# EAGLE design MJ818 clone - all driver (EAGLE 9.4.0)
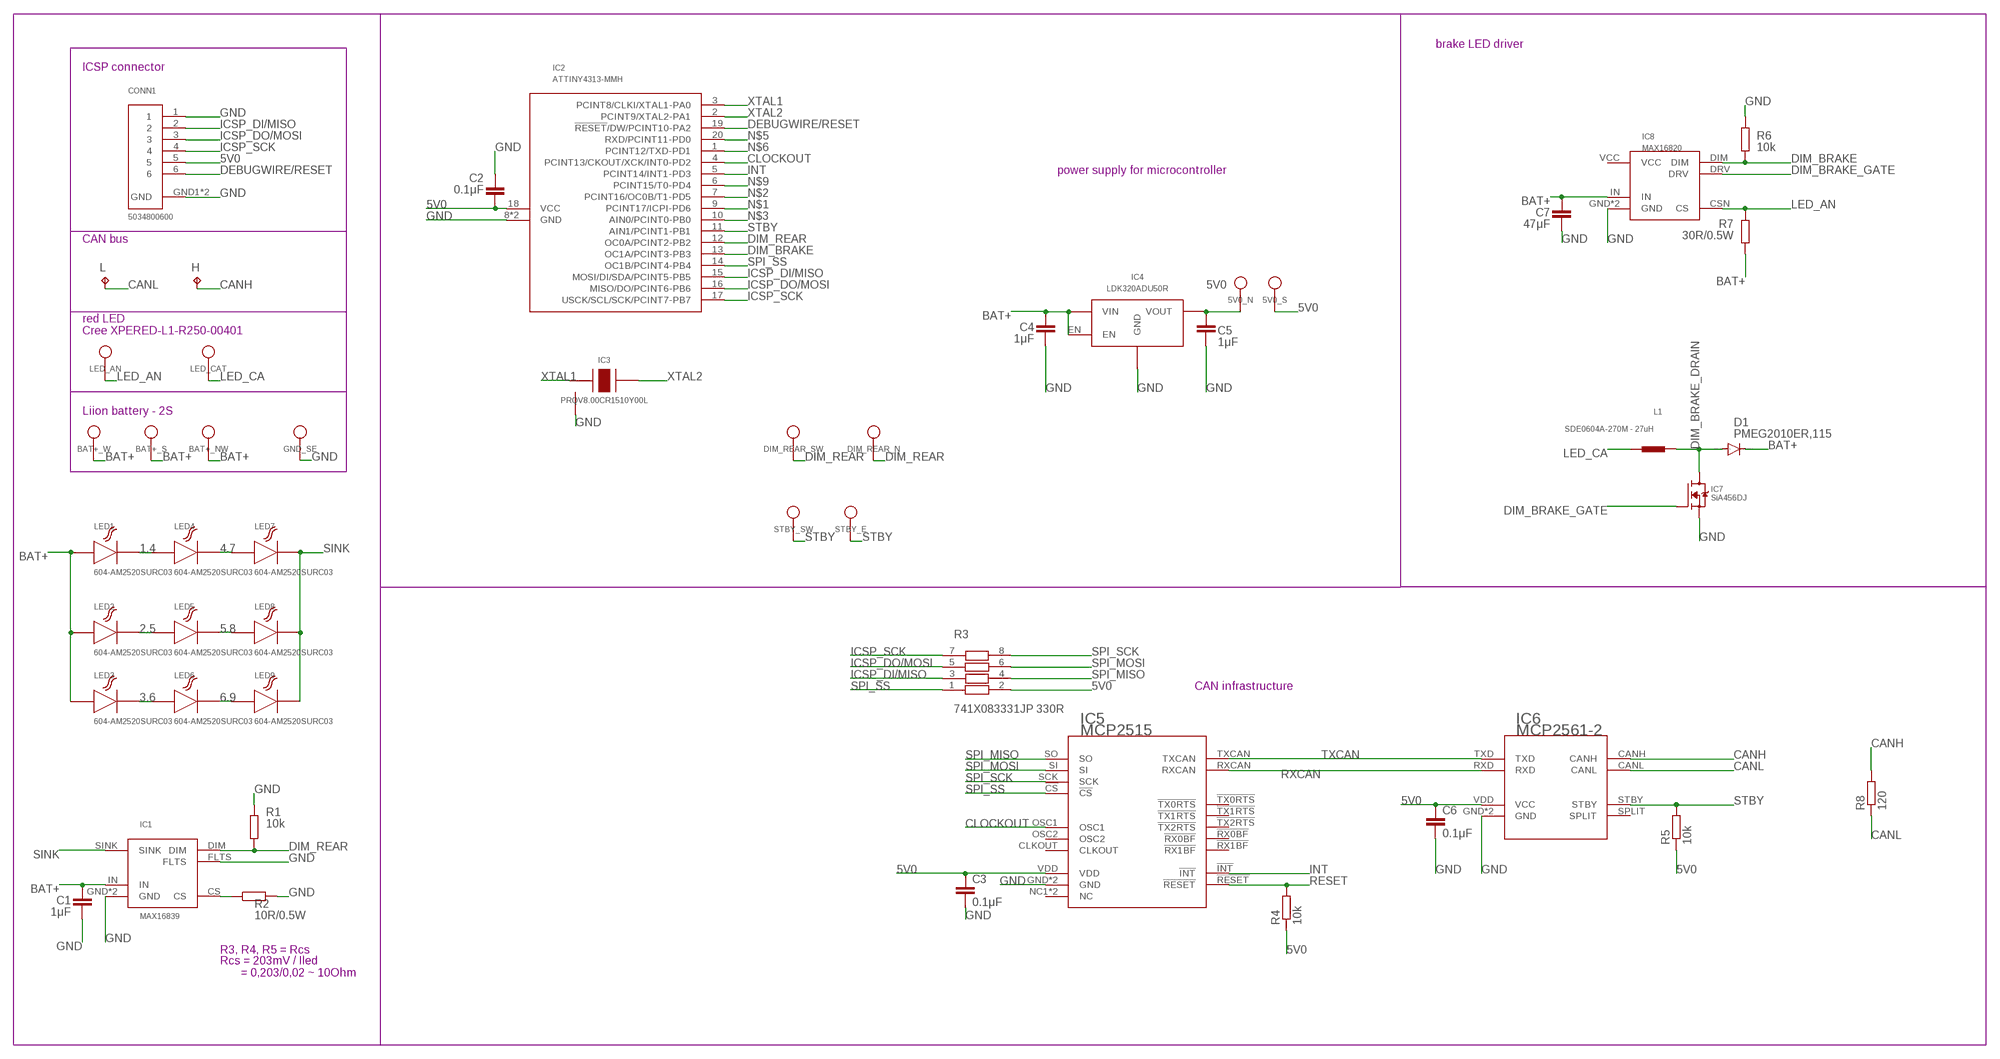
[diagram p0: schematic, sheet 1]

## Parts
5V0_N  TPTH  [TH]
5V0_S  TPTH  [TH]
BAT+_NW  TPTH  [TH]
BAT+_S  TPSMT  [SMT]
BAT+_W  TPTH  [TH]
C1  1μF  C-EUC0402  [C0402]
C2  0.1μF  C-EUC0402  [C0402]
C3  0.1μF  C-EUC1206  [C1206]
C4  1μF  C-EUC0402  [C0402]
C5  1μF  C-EUC0402  [C0402]
C6  0.1μF  C-EUC1206  [C1206]
C7  47μF  C-EUC1206  [C1206]
CONN1  5034800600  [SMT]
D1  PMEG2010ER,115  DIODE-SOD123  [SOD123]
DIM_REAR_N  TPTH  [TH]
DIM_REAR_SW  TPTH  [TH]
GND_SE  TPTH  [TH]
H  TPB2,54  [B2,54]
IC1  MAX16839  MAX16839  [TDFN-6-EP]
IC2  ATTINY4313-MMH  ATTINY4313VQFN-20  [VQFN-20]
IC3  PRQV8.00CR1510Y00L  PRQV  [SMT]
IC4  LDK320ADU50R  LDK320SOT-23-5L  [SOT-23-5L]
IC5  MCP2515  MCP2515-I-ML  [QFN20]
IC6  MCP2561-2  [DFN10]
IC7  SiA456DJ  SIA456DJ  [SC-70-6]
IC8  MAX16820  [TDFN-6-EP]
L  TPB2,54  [B2,54]
L1  SDE0604A-270M - 27uH  DE0604A-778075  [SMT]
LED1  604-AM2520SURC03  AM2520SURC03-31454  [SMD]
LED2  604-AM2520SURC03  AM2520SURC03-31454  [SMD]
LED3  604-AM2520SURC03  AM2520SURC03-31454  [SMD]
LED4  604-AM2520SURC03  AM2520SURC03-31454  [SMD]
LED5  604-AM2520SURC03  AM2520SURC03-31454  [SMD]
LED6  604-AM2520SURC03  AM2520SURC03-31454  [SMD]
LED7  604-AM2520SURC03  AM2520SURC03-31454  [SMD]
LED8  604-AM2520SURC03  AM2520SURC03-31454  [SMD]
LED9  604-AM2520SURC03  AM2520SURC03-31454  [SMD]
LED_AN  TPTH  [TH]
LED_CAT  TPTH  [TH]
R1  10k  R-EU_R0402  [R0402]
R2  10R/0.5W  R-EU_R0603  [R0603]
R3  741X083331JP 330R  741X083331JP  [0402]
R4  10k  R-EU_R0402  [R0402]
R5  10k  R-EU_R0603  [R0603]
R6  10k  R-EU_R0402  [R0402]
R7  30R/0.5W  R-EU_R1206  [R1206]
R8  120  R-EU_R0805  [R0805]
STBY_E  TPTH  [TH]
STBY_SW  TPTH  [TH]

## Nets
1.4 [currett-0.25mA]: LED1.C LED4.A
2.5 [currett-0.25mA]: LED2.C LED5.A
3.6 [currett-0.25mA]: LED3.C LED6.A
4.7 [currett-0.25mA]: LED4.C LED7.A
5.8 [currett-0.25mA]: LED5.C LED8.A
5V0 [VCC]: 5V0_N.TP$1 5V0_S.TP$1 C2.1 C3.1 C5.2 C6.1 CONN1.5 IC2.18(VCC) IC4.OUT(VOUT) IC5.VDD IC6.VDD(VCC) R3.2 R4.1 R5.1
6.9 [currett-0.25mA]: LED6.C LED9.A
BAT+ [currett-0.25mA]: BAT+_NW.TP$1 BAT+_S.P$1(TP$1) BAT+_W.TP$1 C1.2 C4.1 C7.1 D1.C IC1.IN IC4.EN IC4.IN(VIN) IC8.IN LED1.A LED2.A LED3.A R7.2
CANH [signal]: H.TP IC6.CANH R8.2
CANL [signal]: IC6.CANL L.TP R8.1
CLOCKOUT [signal]: IC2.4(PCINT13/CKOUT/XCK/INT0-PD2) IC5.OSC1
CS [signal]: IC1.CS R2.1
DEBUGWIRE/RESET [signal]: CONN1.6 IC2.19(!RESET!/DW/PCINT10-PA2)
DIM_BRAKE [signal]: IC2.13(OC1A/PCINT3-PB3) IC8.DIM R6.1
DIM_BRAKE_DRAIN: D1.A IC7.1D(D) IC7.2D(D) IC7.5D(D) IC7.6D(D) IC7.D L1.P$2
DIM_BRAKE_GATE [signal]: IC7.3G(G) IC8.DRV
DIM_REAR [signal]: DIM_REAR_N.TP$1 DIM_REAR_SW.TP$1 IC1.DIM IC2.12(OC0A/PCINT2-PB2) R1.1
GND: C1.1 C2.2 C3.2 C4.2 C5.1 C6.2 C7.2 CONN1.1 CONN1.GND1(GND) CONN1.GND2(GND) GND_SE.TP$1 IC1.FLTS IC1.GND IC1.GND1(GND) IC2.8(GND) IC2.GND IC3.GND IC4.GND IC5.GND IC5.GND6(GND) IC6.GND IC6.VSS(GND) IC7.4S(S) IC7.S IC8.GND IC8.GND1(GND) R1.2 R2.2 R6.2
ICSP_DI/MISO [signal]: CONN1.2 IC2.15(MOSI/DI/SDA/PCINT5-PB5) R3.3
ICSP_DO/MOSI [signal]: CONN1.3 IC2.16(MISO/DO/PCINT6-PB6) R3.5
ICSP_SCK [signal]: CONN1.4 IC2.17(USCK/SCL/SCK/PCINT7-PB7) R3.7
INT [signal]: IC2.5(PCINT14/INT1-PD3) IC5.!INT!
LED_AN [currett-0.25mA]: IC8.CSN(CS) LED_AN.TP$1 R7.1
LED_CA: L1.P$1 LED_CAT.TP$1
N$1: IC2.9(PCINT17/ICPI-PD6)
N$2: IC2.7(PCINT16/OC0B/T1-PD5)
N$3: IC2.10(AIN0/PCINT0-PB0)
N$5: IC2.20(RXD/PCINT11-PD0)
N$6: IC2.1(PCINT12/TXD-PD1)
N$9: IC2.6(PCINT15/T0-PD4)
RESET [signal]: IC5.!RESET! R4.2
RXCAN [signal]: IC5.RXCAN IC6.RXD
SINK [currett-0.25mA]: IC1.SINK LED7.C LED8.C LED9.C
SPI_MISO [signal]: IC5.SO R3.4
SPI_MOSI [signal]: IC5.SI R3.6
SPI_SCK [signal]: IC5.SCK R3.8
SPI_SS [signal]: IC2.14(OC1B/PCINT4-PB4) IC5.!CS! R3.1
STBY [signal]: IC2.11(AIN1/PCINT1-PB1) IC6.STBY R5.2 STBY_E.TP$1 STBY_SW.TP$1
TXCAN [signal]: IC5.TXCAN IC6.TXD
XTAL1 [signal]: IC2.3(PCINT8/CLKI/XTAL1-PA0) IC3.XTAL1
XTAL2 [signal]: IC2.2(PCINT9/XTAL2-PA1) IC3.XTAL2
Unconnected: IC5.!RX0BF! IC5.!RX1BF! IC5.!TX0RTS! IC5.!TX1RTS! IC5.!TX2RTS! IC5.CLKOUT IC5.NC1(NC) IC5.NC2(NC) IC5.OSC2 IC6.SPLIT

## Notes on the sheet
- brake LED driver
- ICSP connector
- power supply for microcontroller
- CAN bus
- red LED
  Cree XPERED-L1-R250-00401
- Liion battery - 2S
- CAN infrastructure
- R3, R4, R5 = Rcs
- Rcs = 203mV / Iled
         = 0,203/0,02 ~ 10Ohm

## Power pins joined to a net without a drawn wire
VCC: IC8.VCC

## Library data of the parts
5V0_N 5V0_S BAT+_NW BAT+_S BAT+_W DIM_REAR_N DIM_REAR_SW GND_SE LED_AN LED_CAT STBY_E STBY_SW = signal testpoint:TP
C1-C7 = rcl:C-EU: CAPACITOR, European symbol; SPICEPREFIX: C
CONN1 = 5034800600 FPC Connector:5034800600
D1 = diode:DIODE-: DIODE
H L = testpad:TP: Test pad
IC1 = MAX16839 LED Driver, constant current:MAX16839
IC2 = ATtiny4313 microcontroller:ATTINY4313; SPICEPREFIX: X
IC3 = PRQV8.00CR1510Y00L - 8MHz resonator:PRQV
IC4 = LDK320 5V LDO:LDK320
IC5 = MCP2515-I-ML - Standalonce CAN Controller with SPI Interface:MCP2515-I-ML
IC6 = MCP2561-2 - High-Speed CAN Transceiver:MCP2561-2
IC7 = SIA456DJ-T1-GE3  N-Fet:SIA456DJ
IC8 = MAX16820 LED Driver, constant current:MAX16820
L1 = DE0604A-778075 - Inductor:DE0604A-778075
LED1-LED9 = AM2520SURC03-31454 - Red SMD LED:AM2520SURC03-31454
R1 R2 R4-R8 = rcl:R-EU_: RESISTOR, European symbol; SPICEPREFIX: R
R3 = 74x-1133528 Resistor Array:741X083331JP

## Net classes
0 GND: width 0.254 mm, drill 0.254 mm, clearance 0.127 mm
1 VCC: width 0.254 mm, drill 0.254 mm, clearance 0.127 mm
2 signal: width 0.127 mm, drill 0.254 mm, clearance 0.127 mm
3 5V0CAN: width 0.254 mm, drill 0.254 mm, clearance 0.127 mm
4 5V0_μC: width 0.254 mm, drill 0.254 mm, clearance 0.127 mm
5 currett-0.25mA: width 0.254 mm, drill 0.254 mm, clearance 0.127 mm

## Board
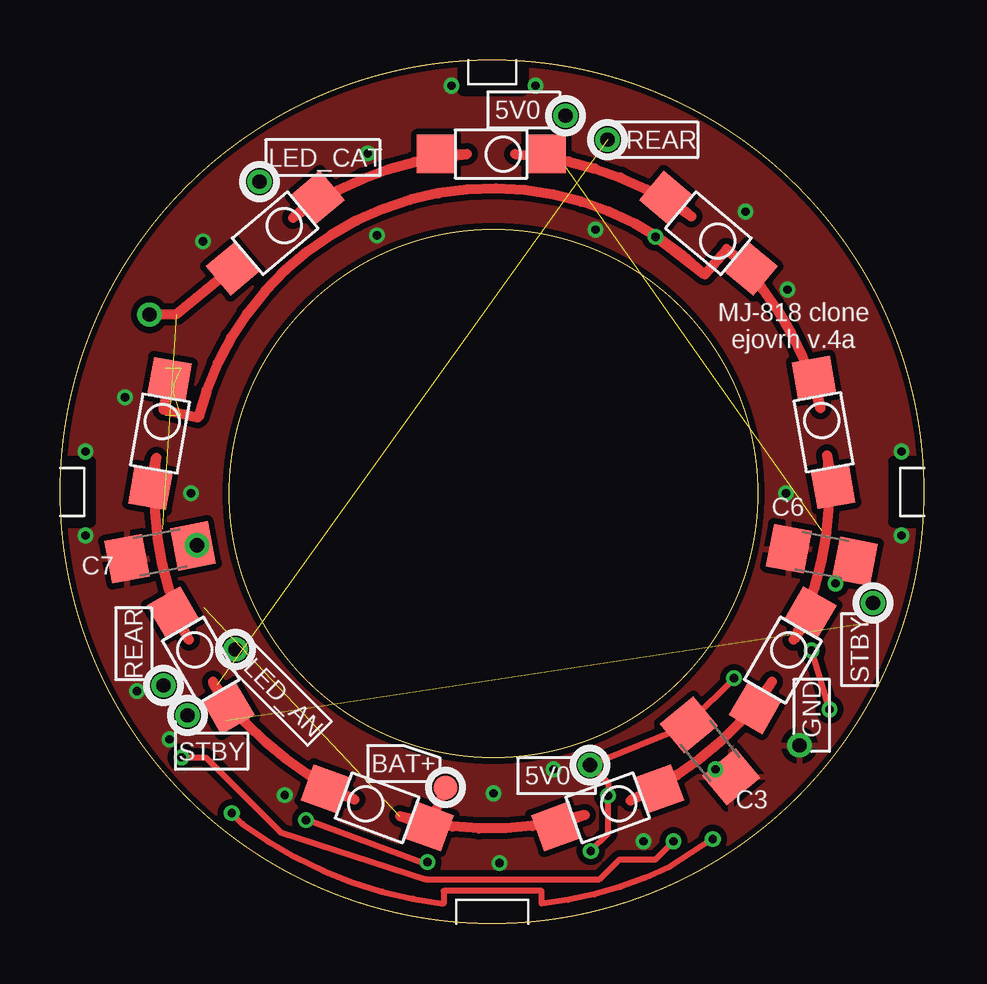
[diagram p1: board, top side]
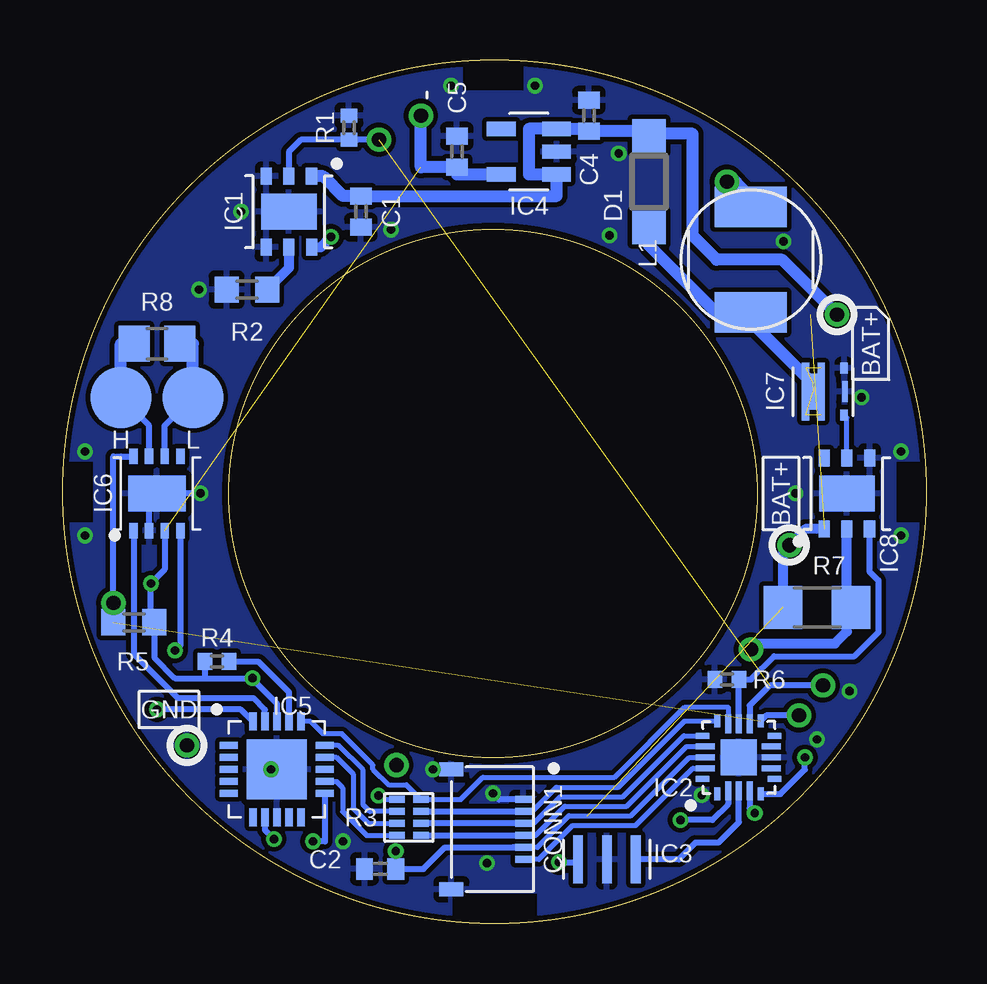
[diagram p2: board, bottom side, seen from below]

Size 36 x 36 mm. Coordinates in mm from the lower left corner, seen from the top.
Outline: 36,17.5 36,18.5
Outline: circle at 18,18 radius 18
Outline: circle at 18.07,17.93 radius 11
Copper layers (1*16): Top 0.035mm / dielectric 1.5mm / Bottom 0.035mm
Design rules "markovac_2layer *": minimum track width 0.2mm, minimum drill 0.35mm, track to track 0.2mm, track to pad 0.2mm, pad to pad 0.2mm, via to via 0.2mm, smd to smd 0.2mm, copper to edge 0.25mm, drill to drill 8mil, minimum pad ring 0.15mm, minimum via ring 0.15mm, stop-mask expansion 4mil, vias tented up to drill 0.34mm, thermal gap 10mil
tKeepout: area 34.8,16.8 to 36,19.2; area 0,16.8 to 1.2,19.2; 4 lines
bKeepout: area 0,16.8 to 1.2,19.2; 4 lines
tRestrict: area 34.8,16.8 to 36,19.2; area 16.8,34.8 to 19.3,36; area 16.8,34.8 to 19.3,36; area 0,16.8 to 1.2,19.2; area 16.2,0 to 19.8,1.2; area 16.2,0 to 19.8,1.2
bRestrict: area 34.8,16.8 to 36,19.2; area 34.8,16.8 to 36,19.2; area 16.8,34.8 to 19.3,36; area 16.8,34.8 to 19.3,36; area 0,16.8 to 1.2,19.2; area 16.2,0 to 19.8,1.2; area 16.2,0 to 19.8,1.2

### Footprints (pad centres in the part's own frame; a part is rotated, then mirrored left to right if it is on the bottom)
TH = drill 0.6 pad 1.016: TP$1 0,0
SMT = smd 1 x 1: P$1 0,0
C0402 = smd 0.7 x 0.9: 1 -0.65,0; 2 0.65,0
C1206 = smd 1.6 x 1.8: 1 -1.4,0; 2 1.4,0
SMT' = smd 0.3 x 0.7: 1 -1.25,1.27; 2 -0.75,1.27; 3 -0.25,1.27; 4 0.25,1.27; 5 0.75,1.27; 6 1.25,1.27 | smd 0.6 x 1: GND1 -2.5,-1.73; GND2 2.5,-1.73
SOD123 = smd 1.4 x 1.4: A 1.9,0; C -1.9,0
B2,54 = smd 2.54 x 2.54: TP 0,0
TDFN-6-EP = smd 0.71 x 0.46: CS 1.48,0; DIM -1.48,0; FLTS -1.48,-0.94; GND1 1.48,-0.95; IN -1.48,0.94; SINK 1.48,0.95 | smd 1.5 x 2.3: GND 0,0
VQFN-20 = smd 0.55 x 0.25: 1 -1.52,0.9; 5 -1.52,-0.9; 11 1.52,-0.9; 15 1.52,0.9 | smd 0.8 x 0.25: 2 -1.4,0.45; 3 -1.4,0; 4 -1.4,-0.45; 12 1.4,-0.45; 13 1.4,0; 14 1.4,0.45 | smd 0.25 x 0.55: 6 -0.9,-1.48; 10 0.9,-1.48; 16 0.9,1.52; 20 -0.9,1.52 | smd 0.25 x 0.8: 7 -0.45,-1.35; 8 0,-1.35; 9 0.45,-1.35; 17 0.45,1.4; 18 0,1.4; 19 -0.45,1.4 | smd 1.5 x 1.5: GND 0,0
SMT'' = smd 0.4 x 2: GND 0,0; XTAL1 -1.2,0; XTAL2 1.2,0
SOT-23-5L = smd 0.6 x 1.2: ADJ/NC -0.95,-1.15; EN -0.95,1.15; GND 0,1.15; IN 0.95,1.15; OUT 0.95,-1.15
QFN20 = smd 0.3 x 0.75: !CS! 1,2; !RESET! 0.5,2; !RX0BF! 1,-2; !RX1BF! 0.5,-2; GND6 0,-2; OSC1 -0.5,-2; OSC2 -1,-2; RXCAN -1,2; TXCAN -0.5,2; VDD 0,2 | smd 0.75 x 0.3: !INT! 2,-1; !TX0RTS! -2,0.5; !TX1RTS! -2,0; !TX2RTS! -2,-1; CLKOUT -2,1; NC1 -2,-0.5; NC2 2,0; SCK 2,-0.5; SI 2,0.5; SO 2,1 | smd 2.5 x 2.5: GND 0,0
DFN10 = smd 0.35 x 0.65: CANH -0.325,1.55; CANL 0.325,1.55; RXD 0.975,-1.55; SPLIT 0.975,1.55; STBY -0.975,1.55; TXD -0.975,-1.55; VDD 0.325,-1.55; VSS -0.325,-1.55 | smd 2.4 x 1.5: GND 0,0
SC-70-6 = smd 0.45 x 0.3: 1D -0.975,0.725; 2D -0.975,0.075; 3G -0.975,-0.88; 4S 0.975,-0.88; 5D 0.975,0.075; 6D 0.975,0.725 | smd 1.5 x 0.95: D 0,0.4 | smd 0.87 x 0.23: S 0,-0.915
TDFN-6-EP' = smd 0.71 x 0.46: CSN -1.48,0; DIM -1.48,-0.94; DRV 1.48,0; GND1 1.48,-0.95; IN -1.48,0.94; VCC 1.48,0.95 | smd 1.5 x 2.3: GND 0,0
SMT''' = smd 1.7 x 3: P$1 2.2,0; P$2 -2.2,0
SMD = smd 1.6 x 1.6: A -2.3,0; C 2.3,0
R0402 = smd 0.6 x 0.7: 1 -0.5,0; 2 0.5,0
R0603 = smd 1 x 1.1: 1 -0.85,0; 2 0.85,0
0402 = smd 0.65 x 0.3: 1 -0.5,-0.75; 2 0.5,-0.75; 3 -0.5,-0.25; 4 0.5,-0.25; 5 -0.5,0.25; 6 0.5,0.25; 7 -0.5,0.75; 8 0.5,0.75
R1206 = smd 1.6 x 1.803: 1 -1.422,0; 2 1.422,0
R0805 = smd 1.3 x 1.5: 1 -0.95,0; 2 0.95,0

### Placement (x,y rotation side)
5V0_N  21.07,33.68 180 top
5V0_S  22.09,6.61 0 top
BAT+_NW  3.73,25.39 0 bottom
BAT+_S  16.07,5.68 0 top
BAT+_W  5.72,15.78 0 bottom
C1  23.57,29.68 90 bottom
C2  22.77,2.28 180 bottom
C3  27.09,7.2 309.3 top
C4  14.07,33.68 90 bottom
C5  19.57,32.18 270 bottom
C6  31.74,15.36 169.2 top
C7  4.17,15.48 191 top
CONN1  5034800600  [SMT']  18.07,3.93 270 bottom
D1  11.57,30.93 270 bottom
DIM_REAR_N  22.82,32.68 0 top
DIM_REAR_SW  4.32,9.93 0 top
GND_SE  30.82,7.43 180 bottom
H  33.57,21.93 90 bottom
IC1  26.57,29.68 270 bottom
IC2  7.82,6.93 90 bottom
IC3  PRQV8.00CR1510Y00L  [SMT'']  13.32,2.68 180 bottom
IC4  16.57,32.18 270 bottom
IC5  27.07,6.43 0 bottom
IC6  32.07,17.93 0 bottom
IC7  4.32,22.18 90 bottom
IC8  MAX16820  [TDFN-6-EP']  3.32,17.93 90 bottom
L  30.57,21.93 90 bottom
L1  SDE0604A-270M - 27uH  [SMT''']  7.32,27.68 90 bottom
LED1  22.82,4.83 20 top
LED2  13.22,4.83 160 top
LED3  8.97,28.78 40 top
LED4  30.12,10.98 60 top
LED5  5.87,10.98 120 top
LED6  17.97,32.08 0 top
LED7  31.82,20.48 100 top
LED8  4.17,20.43 80 top
LED9  27.02,28.78 320 top
LED_AN  7.32,11.43 0 top
LED_CAT  8.32,30.93 0 top
R1  24.07,33.18 90 bottom
R2  28.32,26.43 180 bottom
R3  21.57,4.43 180 bottom
R4  29.57,10.93 0 bottom
R5  33.03,12.56 180 bottom
R6  8.32,10.18 180 bottom
R7  4.57,13.18 180 bottom
R8  32.07,24.18 180 bottom
STBY_E  33.88,13.37 0 top
STBY_SW  5.32,8.68 0 top

### Tracks (layer width: path | path; a pad name or v marks a point on that pad's centre or on a via)
1.4
  Top 0.406: LED4.A 29.67,10.08 arc-32 23.77,5.13 LED1.C
2.5
  Top 0.254: LED2.C
  Top 0.406: LED2.C 12.27,5.18 arc-32 6.37,10.08 LED5.A
3.6
  Top 0.406: LED6.A 16.97,32.08 arc32 9.72,29.43 LED3.C | LED3.C
4.7
  Top 0.254: LED7.A
  Top 0.406: LED7.A 31.97,19.53 arc-32 30.57,11.83 LED4.C
5.8
  Top 0.254: LED8.A
  Top 0.406: LED5.C 5.37,11.83 arc-32 4.02,19.43 LED8.A
5V0  (via drill 0.35)  (1 unrouted)
  Top 0.254: 22.32,3.23 v22.12,3.03 22.84,3.75 v22.84,5.33 22.84,5.86 5V0_S.TP$1 C3.1 26.3,8.44 v28.09,10.23 | v32.32,14.18 C6.1
  Bottom 0.2: IC2.18 9.88,6.93 12.31,4.49 14.9,4.49 16.22,3.18 CONN1.5 | v22.84,5.33 22.69,5.18 R3.2
  Bottom 0.254: 17.27,3.18 CONN1.5 20.07,3.18 20.97,2.28 C2.1 v22.12,3.03 | IC5.VDD 27.07,9.18 28.09,10.2 v28.09,10.23 30.07,10.23 | IC6.VDD | 30.07,10.23 31.32,10.23 32.18,11.09 R5.1 32.32,12.7 v32.32,14.18 31.74,14.75 IC6.VDD | R4.1 30.07,10.23
  Bottom 0.508: IC4.OUT 19.57,31.23 C5.2 21.07,31.53 5V0_N.TP$1
6.9
  Top 0.305: LED6.C 18.97,32.08 | LED9.A 25.48,30.18
  Top 0.406: 25.48,30.18 26.32,29.48 arc32 18.97,32.08
BAT+  (2 unrouted)
  Top 0.254: 3.54,25.39 BAT+_NW.TP$1
  Top 0.406: LED1.A 21.87,4.53 arc-32 14.17,4.48 | 14.17,4.48 15.14,4.13 LED2.A | 7.17,27.3 4.84,25.39 BAT+_NW.TP$1 | LED2.A 14.17,4.48 | LED2.A BAT+_S.P$1 | C7.1 BAT+_W.TP$1
  Top 0.508: LED2.A 15.14,4.13 | LED3.A 7.17,27.3
  Bottom 0.406: 5.82,13.35 R7.2 5.99,15.5 BAT+_W.TP$1 5.05,16.45 IC8.IN
  Bottom 0.508: IC1.IN 25.15,31.16 24.32,30.33 C1.2 15.42,30.33 IC4.IN 16.57,31.23 16.57,33.13 IC4.EN 14.17,33.13 C4.1 11.77,33.03 D1.C 11.57,32.93 9.75,32.93 9.75,28.68 8.75,27.68 6.02,27.68 BAT+_NW.TP$1
CANH
  Bottom 0.254: IC6.CANH 32.39,20.75 H.TP
  Bottom 0.508: H.TP 33.57,24.18 R8.2
CANL
  Bottom 0.254: IC6.CANL 31.74,20.75 L.TP
  Bottom 0.508: L.TP 30.57,24.18 R8.1
CLOCKOUT  (via drill 0.35)
  Top 0.254: v7.16,4.61 7.6,4.17 arc30 15.99,0.83 15.99,1.36 20.07,1.36 20.07,0.82 arc20 25.42,2.37 v27.2,3.53
  Bottom 0.254: IC2.4 7.37,4.82 v7.16,4.61 | IC5.OSC1 27.57,3.9 v27.2,3.53
CS
  Bottom 0.406: IC1.CS 26.57,27.33 R2.1
DEBUGWIRE/RESET
  Bottom 0.2: IC2.19 9.73,6.48 12.12,4.09 14.74,4.09 16.15,2.68 CONN1.6
DIM_BRAKE
  Bottom 0.25: 6.35,11.14 3.01,11.14 2.01,12.14 2.01,14.31 2.38,14.68 IC8.DIM
  Bottom 0.254: 6.35,11.14 7.32,10.18 R6.1 IC2.13
DIM_BRAKE_DRAIN  (5 unrouted)
  Bottom 0.508: D1.A 11.57,28.28 8.77,25.48 L1.P$2 7.32,25.1 4.73,22.51
DIM_BRAKE_GATE
  Bottom 0.2: IC8.DRV 3.32,21.08 IC7.3G
DIM_REAR  (1 unrouted)
  Bottom 0.254: IC2.12 7.37,9.09 6.53,9.93 DIM_REAR_SW.TP$1 | IC1.DIM 26.57,32.18 26.07,32.68 R1.1 DIM_REAR_N.TP$1 23.71,32.68
GND  (via drill 0.35)
  Top 0.254: v27.32,6.43 C3.2
  Bottom 0.254: IC6.VSS 32.39,17.93 IC6.GND v30.25,17.93 | 2.37,17.93 IC8.GND | CONN1.1 17.82,5.18 v18.07,5.43
  other vias: 16.32,34.93 19.82,34.93 1.07,19.68 1.07,16.18 35.07,19.68 35.07,16.18 18.32,2.52 20.57,6.43 4.57,7.68 9.37,5.35 24.32,3.43 5.96,28.43 2.71,21.93 5.46,17.93 13.21,28.68 30.32,26.43 28.57,29.68 22.32,28.93 12.82,32.11 3.21,9.68
  pour Bottom: -0.43,36.43 -0.43,-0.57 36.57,-0.57 36.57,36.43
  pour Top (isolate 0.254): -0.43,36.43 36.57,36.43 36.57,-0.57 -0.43,-0.57
ICSP_DI/MISO
  Bottom 0.2: IC2.15 10.08,8.45 12.84,5.69 15.43,5.69 16.44,4.68 CONN1.2
  Bottom 0.254: R3.3 CONN1.2
ICSP_DO/MOSI
  Bottom 0.2: IC2.16 10.11,7.83 12.65,5.28 15.26,5.28 16.37,4.18 CONN1.3
  Bottom 0.254: CONN1.3 R3.5
ICSP_SCK
  Bottom 0.2: IC2.17 10,7.38 12.48,4.89 15.07,4.89 16.29,3.68 CONN1.4
  Bottom 0.254: R3.7 CONN1.4
INT  (via drill 0.35)
  Top 0.254: v25.57,3.43 24.82,2.68 23.32,2.68 22.49,1.85 15.24,1.85 9.19,3.8 6.07,6.93 v5.07,6.93
  Bottom 0.254: v25.57,3.43 25.07,3.43 IC5.!INT! | IC2.5 6.09,5.41 5.07,6.43 v5.07,6.93
LED_AN
  Bottom 0.406: R7.1 3.32,13.18 | 3.32,13.18 3.32,12.18 3.82,11.68 7.07,11.68 LED_AN.TP$1 | 3.32,13.18 IC8.CSN
LED_CA
  Bottom 1.016: L1.P$1 LED_CAT.TP$1
RESET
  Bottom 0.254: IC5.!RESET! 26.57,9.65 27.85,10.93 R4.2
RXCAN  (via drill 0.35)
  Top 0.254: v32.07,8.93 32.05,8.94 v31.32,11.39
  Bottom 0.25: IC6.RXD 31.09,11.61 v31.32,11.39
  Bottom 0.254: v32.07,8.93 28.57,8.93 IC5.RXCAN
SINK  (via drill 0.35)
  Top 0.254: LED8.C
  Top 0.305: 27.77,28.13 27.77,28.06
  Top 0.406: LED7.C 31.69,21.48 arc32 27.77,28.13 LED9.C | LED8.C 4.32,21.43 5.76,21.1 arc-120 26.87,27.05 | 27.77,28.06 26.87,27.05 | v24.82,28.63 26.87,27.05
  Bottom 0.406: IC1.SINK 25.25,28.2 v24.82,28.63
SPI_MISO
  Bottom 0.2: R3.4 23.2,4.68 23.48,4.96 23.48,6.4 24.5,7.43 IC5.SO
SPI_MOSI
  Bottom 0.2: IC5.SI 24.58,6.93 23.9,6.24 23.9,4.81 23.27,4.18 R3.6
SPI_SCK
  Bottom 0.2: IC5.SCK 24.59,5.93 24.33,5.66 24.33,4.67 23.33,3.68 R3.8
SPI_SS
  Bottom 0.2: IC2.14 8.27,9.03 10.07,9.03 13,6.1 18.49,6.1 19.41,5.18 R3.1 21.67,5.78 22.41,5.78 23.06,6.44 23.06,6.61 24.36,7.91 25.15,7.91 25.66,8.43 IC5.!CS!
STBY  (1 unrouted)
  Bottom 0.254: 33.57,19.48 IC6.STBY 33.88,19.48 R5.2 STBY_E.TP$1 | STBY_SW.TP$1 6.69,8.68 IC2.11
TXCAN
  Bottom 0.254: IC5.TXCAN 27.57,8.93 28.04,9.4 31.2,9.4 33.04,11.23 IC6.TXD
XTAL1
  Bottom 0.254: IC3.XTAL1 10.32,2.68 9.63,3.37 8.67,3.37 7.82,4.22 IC2.3
XTAL2  (via drill 0.35)
  Top 0.254: v10.26,4.32 15.03,2.56 v15.32,2.56
  Bottom 0.254: IC2.2 8.27,4.98 8.93,4.32 v10.26,4.32 | v15.32,2.56 14.64,2.56 IC3.XTAL2

### Text on the board
tPlace: MJ-818 clone / ejovrh v.4a
tNames: 5V0 | REAR | REAR | STBY | GND | STBY | BAT+ | 5V0
bNames: BAT+ | BAT+ | GND